# Altium project Nguon_24V.PrjPcb
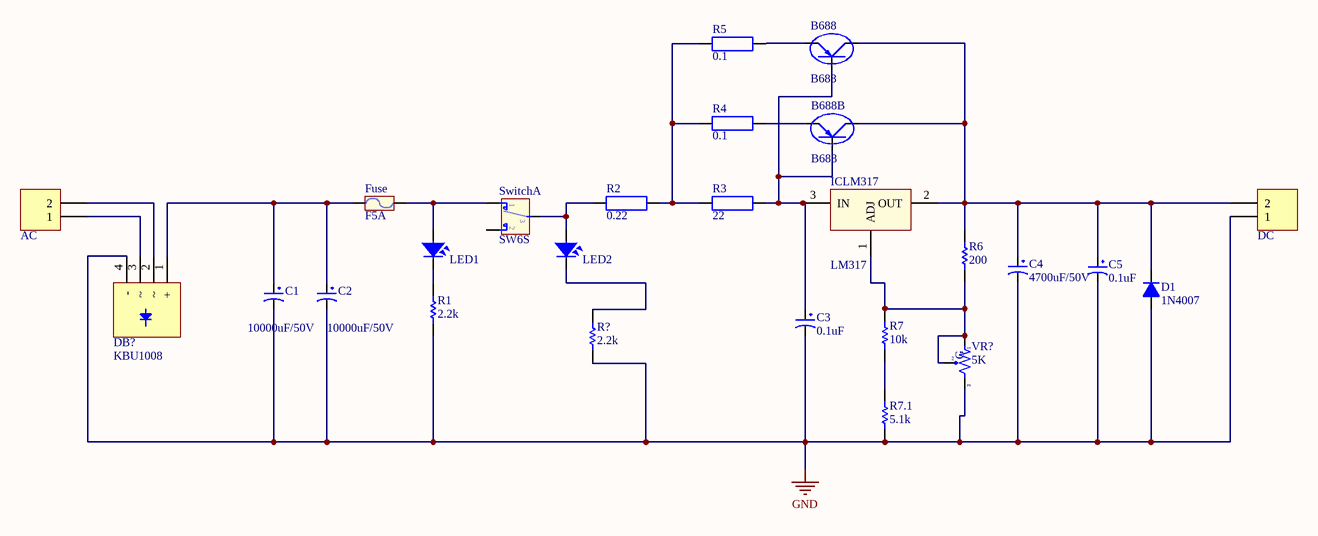
[diagram p0: Sheet1.SchDoc]
1 sheet, 26 parts. Net scope: global (net labels, ports and power ports of the same name join across sheets).
Board file: PCB1.PcbDoc

## Sheet Sheet1.SchDoc
size A

### Parts
AC  Header 2_1  [HED2]  (value not drawn)
B688  B688  [QTO-247]
B688B  B688  [QTO-247]
C1  10000uF/50V  [CP4.5/19]
C2  10000uF/50V  [CP4.5/19]
C3  0.1uF  [CP1/2]
C4  4700uF/50V  [CP4/8.5]
C5  0.1uF  [CP1/2]
D1  1N4007  [D2A]
DB?  KBU1008  [DIODE BRIDGE(FLAT) BIG]
DC  Header 2_1  [HED2]  (value not drawn)
Fuse  F5A  [Fuse]
ICLM317  LM317  [TO-220]
LED1  LED  [LED-3MM-YELLOW]  (value not drawn)
LED2  LED  [LED-3MM-YELLOW]  (value not drawn)
R1  value 2.2k  [R1/4W]  (hidden comment: Res1)
R2  0.22  [DIEN TRO 5W]
R3  22  [DIEN TRO 5W]
R4  0.1  [DIEN TRO 5W]
R5  0.1  [DIEN TRO 5W]
R6  value 200  [R1/4W]  (hidden comment: Res1)
R7  value 10k  [R1/4W]  (hidden comment: Res1)
R7.1  value 5.1k  [R1/4W]  (hidden comment: Res1)
R?  value 2.2k  [R1/4W]  (hidden comment: Res1)
Switch  SW6S  [SW6]  (part A of 2)
VR?  5K  [VR-S1]

### Nets
GND: C1.2 C2.2 C3.2 C4.2 C5.2 D1.1(A) DB?.4(-) DC.1 R1.1 R7.1.1 R?.1 VR?.3
NetAC_1: AC.1 DB?.3
NetAC_2: AC.2 DB?.2
NetB688_1: B688.1(B) B688B.1(B) C3.1 ICLM317.3(IN) R3.2
NetB688_2: B688.2(C) B688B.2(C) C4.1 C5.1 D1.2(K) DC.2 ICLM317.2(OUT) R6.2
NetB688_3: B688.3(E) R5.2
NetB688B_3: B688B.3(E) R4.2
NetC1_1: C1.1 C2.1 DB?.1(+) Fuse.1
NetFuse_2: Fuse.2 LED1.1 Switch.1
NetICLM317_1: ICLM317.1(ADJ) R6.1 R7.2 VR?.1 VR?.2
NetLED1_2: LED1.2 R1.2
NetLED2_1: LED2.1 R2.1 Switch.3
NetLED2_2: LED2.2 R?.2
NetR2_2: R2.2 R3.1 R4.1 R5.1
NetR7_1: R7.1 R7.1.2

Not connected (* = marked no-connect by the designer): Switch 2

### Notes on the sheet
- (in symbol VR-S) G

### Library data of the parts
AC DC = Header 2_1: Header, 2-Pin; Manufacturer: Generic Components; Class: Connector; Value: Header 2
B688 B688B = B688: Transistor Power Supply; Value: B688
C1 C2 = CP9: Cap 10000uF/63V; Value: 220uF/450V
C3 C5 = CP1: Cap P  0,1uF < 22uF , 16 - 50V; Value: 10uF/50V; Description 1: 10 => 220uF/6,3V/10V - 10uF => 100uF/16V; Description 2: 0,1uF => 33uF/50V - 10uF => 22uF/63V; Description 3: 0,47uF => 10uF/100V
C4 = CP7: Cap 4700uF/50V; Value: 4700uF/50V
D1 = D1A: Diode 1A; Value: 1N4007
DB? = Diode Bridge KBU1008: Diode Bridge
Fuse = Fuse: Designed by: VanDungEvn; Value: Fuse
ICLM317 = LM317: Adj Voltage +1.2 -> +37V; Value: LM317
LED1 LED2 = LED: LED Single colour Green and Red; Value: LED 3 ly Single Colour
R1 R6 R7 R7.1 R? = Res1_4: Resistor; Manufacturer: Generic Components; Class: Passive; Published: 08/06/2000; Publisher: Altium Hobart Technology Centre; SubClass: Resistor
R2-R5 = Res 5W: 5W Res Power; Creator: Nguyen Ba Bien
Switch = SW6S: SW-DTDP - 6 Pin; Value: SW6
VR? = VR-S: Var Resistor; Value: Volume 50k